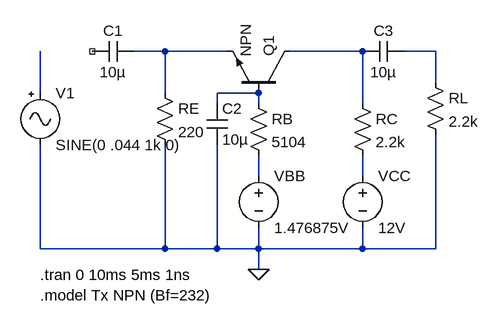
[diagram p0: schematic Draft3.asc]
Draft3.asc, the LTspice schematic file:
Version 4
SHEET 1 880 680
WIRE 224 64 176 64
WIRE 320 64 224 64
WIRE 528 64 416 64
WIRE 640 64 592 64
WIRE 640 112 640 64
WIRE 32 128 32 64
WIRE 224 128 224 64
WIRE 368 128 304 128
WIRE 304 144 304 128
WIRE 368 144 368 128
WIRE 528 144 528 64
WIRE 368 256 368 224
WIRE 528 256 528 224
WIRE 32 368 32 208
WIRE 224 368 224 208
WIRE 224 368 32 368
WIRE 304 368 304 208
WIRE 304 368 224 368
WIRE 368 368 368 336
WIRE 368 368 304 368
WIRE 528 368 528 336
WIRE 528 368 368 368
WIRE 640 368 640 192
WIRE 640 368 528 368
WIRE 368 400 368 368
FLAG 368 400 0
SYMBOL Misc\\signal 32 112 R0
WINDOW 123 0 0 Left 0
WINDOW 39 0 0 Left 0
SYMATTR InstName V1
SYMATTR Value SINE(0 .044 1k 0)
SYMBOL cap 176 48 R90
WINDOW 0 0 32 VBottom 2
WINDOW 3 32 32 VTop 2
SYMATTR InstName C1
SYMATTR Value 10µ
SYMBOL res 208 112 R0
SYMATTR InstName RE
SYMATTR Value 220
SYMBOL cap 288 144 R0
SYMATTR InstName C2
SYMATTR Value 10µ
SYMBOL res 352 128 R0
SYMATTR InstName RB
SYMATTR Value 5104
SYMBOL voltage 368 240 R0
WINDOW 123 0 0 Left 0
WINDOW 39 0 0 Left 0
SYMATTR InstName VBB
SYMATTR Value 1.476875V
SYMBOL voltage 528 240 R0
WINDOW 123 0 0 Left 0
WINDOW 39 0 0 Left 0
SYMATTR InstName VCC
SYMATTR Value 12V
SYMBOL res 512 128 R0
SYMATTR InstName RC
SYMATTR Value 2.2k
SYMBOL cap 592 48 R90
WINDOW 0 0 32 VBottom 2
WINDOW 3 32 32 VTop 2
SYMATTR InstName C3
SYMATTR Value 10µ
SYMBOL res 624 96 R0
SYMATTR InstName RL
SYMATTR Value 2.2k
SYMBOL npn 416 128 M270
SYMATTR InstName Q1
TEXT 32 408 Left 2 !.tran 0 10ms 5ms 1ns
TEXT 32 440 Left 2 !.model Tx NPN (Bf=232)

The netlist it stands for:
* Draft3.asc
V1 N004 0 SINE(0 .044 1k 0)
C1 N001 NC_01 10µ
RE N001 0 220
C2 N005 0 10µ
RB N005 N006 5104
VBB N006 0 1.476875V
VCC N007 0 12V
RC N002 N007 2.2k
C3 N003 N002 10µ
RL N003 0 2.2k
Q1 N002 N005 N001 0 NPN
.model NPN NPN
.model PNP PNP
.lib standard.bjt
.tran 0 10ms 5ms 1ns
.model Tx NPN (Bf=232)
.backanno
.end